# Altium schematic sheet RoboRIOAdapterBoard.SchDoc
size A; SheetNumber: 1; SheetTotal: 1
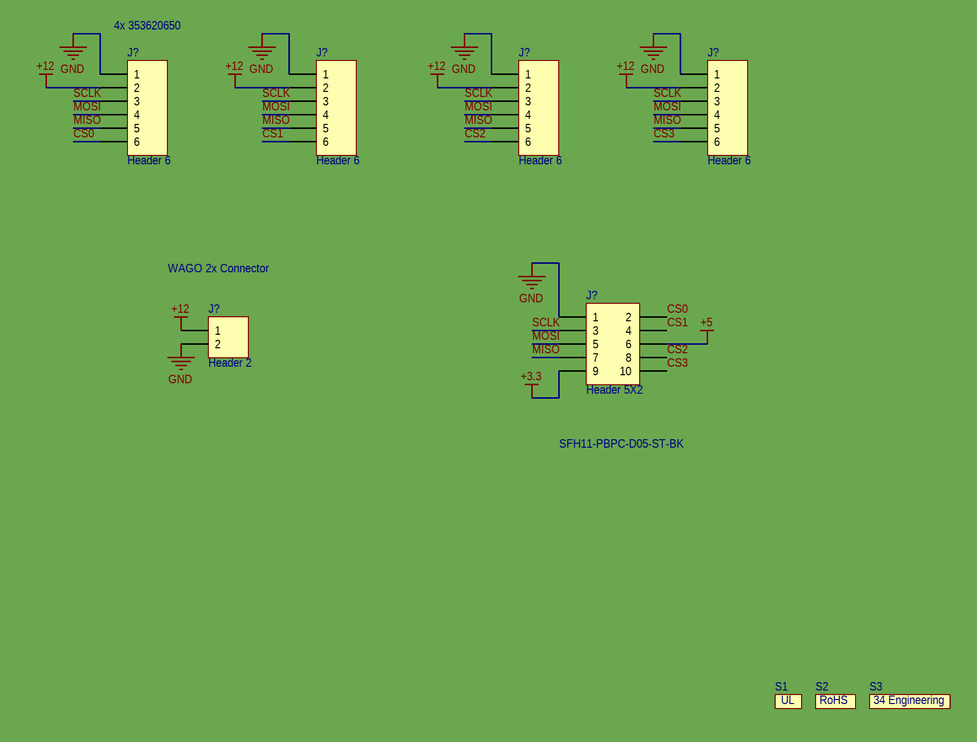
[diagram p0: RoboRIOAdapterBoard.SchDoc]

## Parts
(Parts that share a designator on the sheet are numbered #1, #2 ... from top to bottom, then left to right.)
J?#1  Header 6  [HDR1X6]
J?#2  Header 6  [HDR1X6]
J?#3  Header 6  [HDR1X6]
J?#4  Header 6  [HDR1X6]
J?#5  Header 5X2  [HDR2X5]
J?#6  Header 2  [HDR1X2]
S1  (no value)  [UL]
S2  (no value)  [RoHS]
S3  (no value)  [34EngineeringLogo]

## Nets
+3.3: J?#5.9
+5: J?#5.6
+12: J?#1.2 J?#2.2 J?#3.2 J?#4.2 J?#6.1
GND: J?#1.1 J?#2.1 J?#3.1 J?#4.1 J?#5.1 J?#6.2
CS0: J?#1.6 J?#5.2
CS1: J?#2.6 J?#5.4
CS2: J?#3.6 J?#5.8
CS3: J?#4.6 J?#5.10
MISO: J?#1.5 J?#2.5 J?#3.5 J?#4.5 J?#5.7
MOSI: J?#1.4 J?#2.4 J?#3.4 J?#4.4 J?#5.5
SCLK: J?#1.3 J?#2.3 J?#3.3 J?#4.3 J?#5.3

## Notes on the sheet
- (near J?#1) 4x 353620650
- WAGO 2x Connector
- SFH11-PBPC-D05-ST-BK
- (in symbol 34EngineeringLogo) 34 Engineering

## Library data of the parts
J?#1-J?#4 = Header 6: Header, 6-Pin; LatestRevisionDate: 17-Jul-2002; LatestRevisionNote: Re-released for DXP Platform.; Publisher: Altium Limited
J?#5 = Header 5X2: Header, 5-Pin, Dual row; LatestRevisionDate: 17-Jul-2002; LatestRevisionNote: Re-released for DXP Platform.; Publisher: Altium Limited
J?#6 = Header 2: Header, 2-Pin; LatestRevisionDate: 17-Jul-2002; LatestRevisionNote: Re-released for DXP Platform.; Publisher: Altium Limited
S1 = UL
S2 = RoHS
S3 = 34EngineeringLogo: 34 Engineering Silkscreen Logo